# Altium schematic sheet BMS028B_Interface.SchDoc: Interface
size 431 x 279 mm; Date: Not shown in title block; ApprovedBy: Not shown in title block; CheckedBy: Not shown in title block; Author: Not shown in title block; CompanyName: Not shown in title block; DrawnBy: M Sunna; Engineer: Not shown in title block; Organization: Not shown in title block; Address1: Not shown in title block; Address2: Not shown in title block; Address3: Not shown in title block; Address4: Not shown in title block; DocumentNumber: 4; Revision: Use project parameter SCH_Rev; SheetNumber: 4; SheetTotal: 5; PageSetup: Record=PageOptions|CenterHorizontal=True|CenterVertical=True|PrintScale=1.00|XCorrection=1.00|YCorrection=1.00|PrintKind=0|BorderSize=5000000|LeftOffset=0|BottomOffset=0|Orientation=2|PaperLength=1000|PaperWidth=1000|Scale=100|PaperSource=15|PrintQuality=600|MediaType=1|DitherType=10|PaperKind=Letter|PrintScaleMode=1; CurrentTime: Not shown in title block; CurrentDate: Not shown in title block; Time: Not shown in title block; DocumentFullPathAndName: Not shown in title block; DocumentName: Not shown in title block; ModifiedDate: Not shown in title block; ImagePath: Not shown in title block
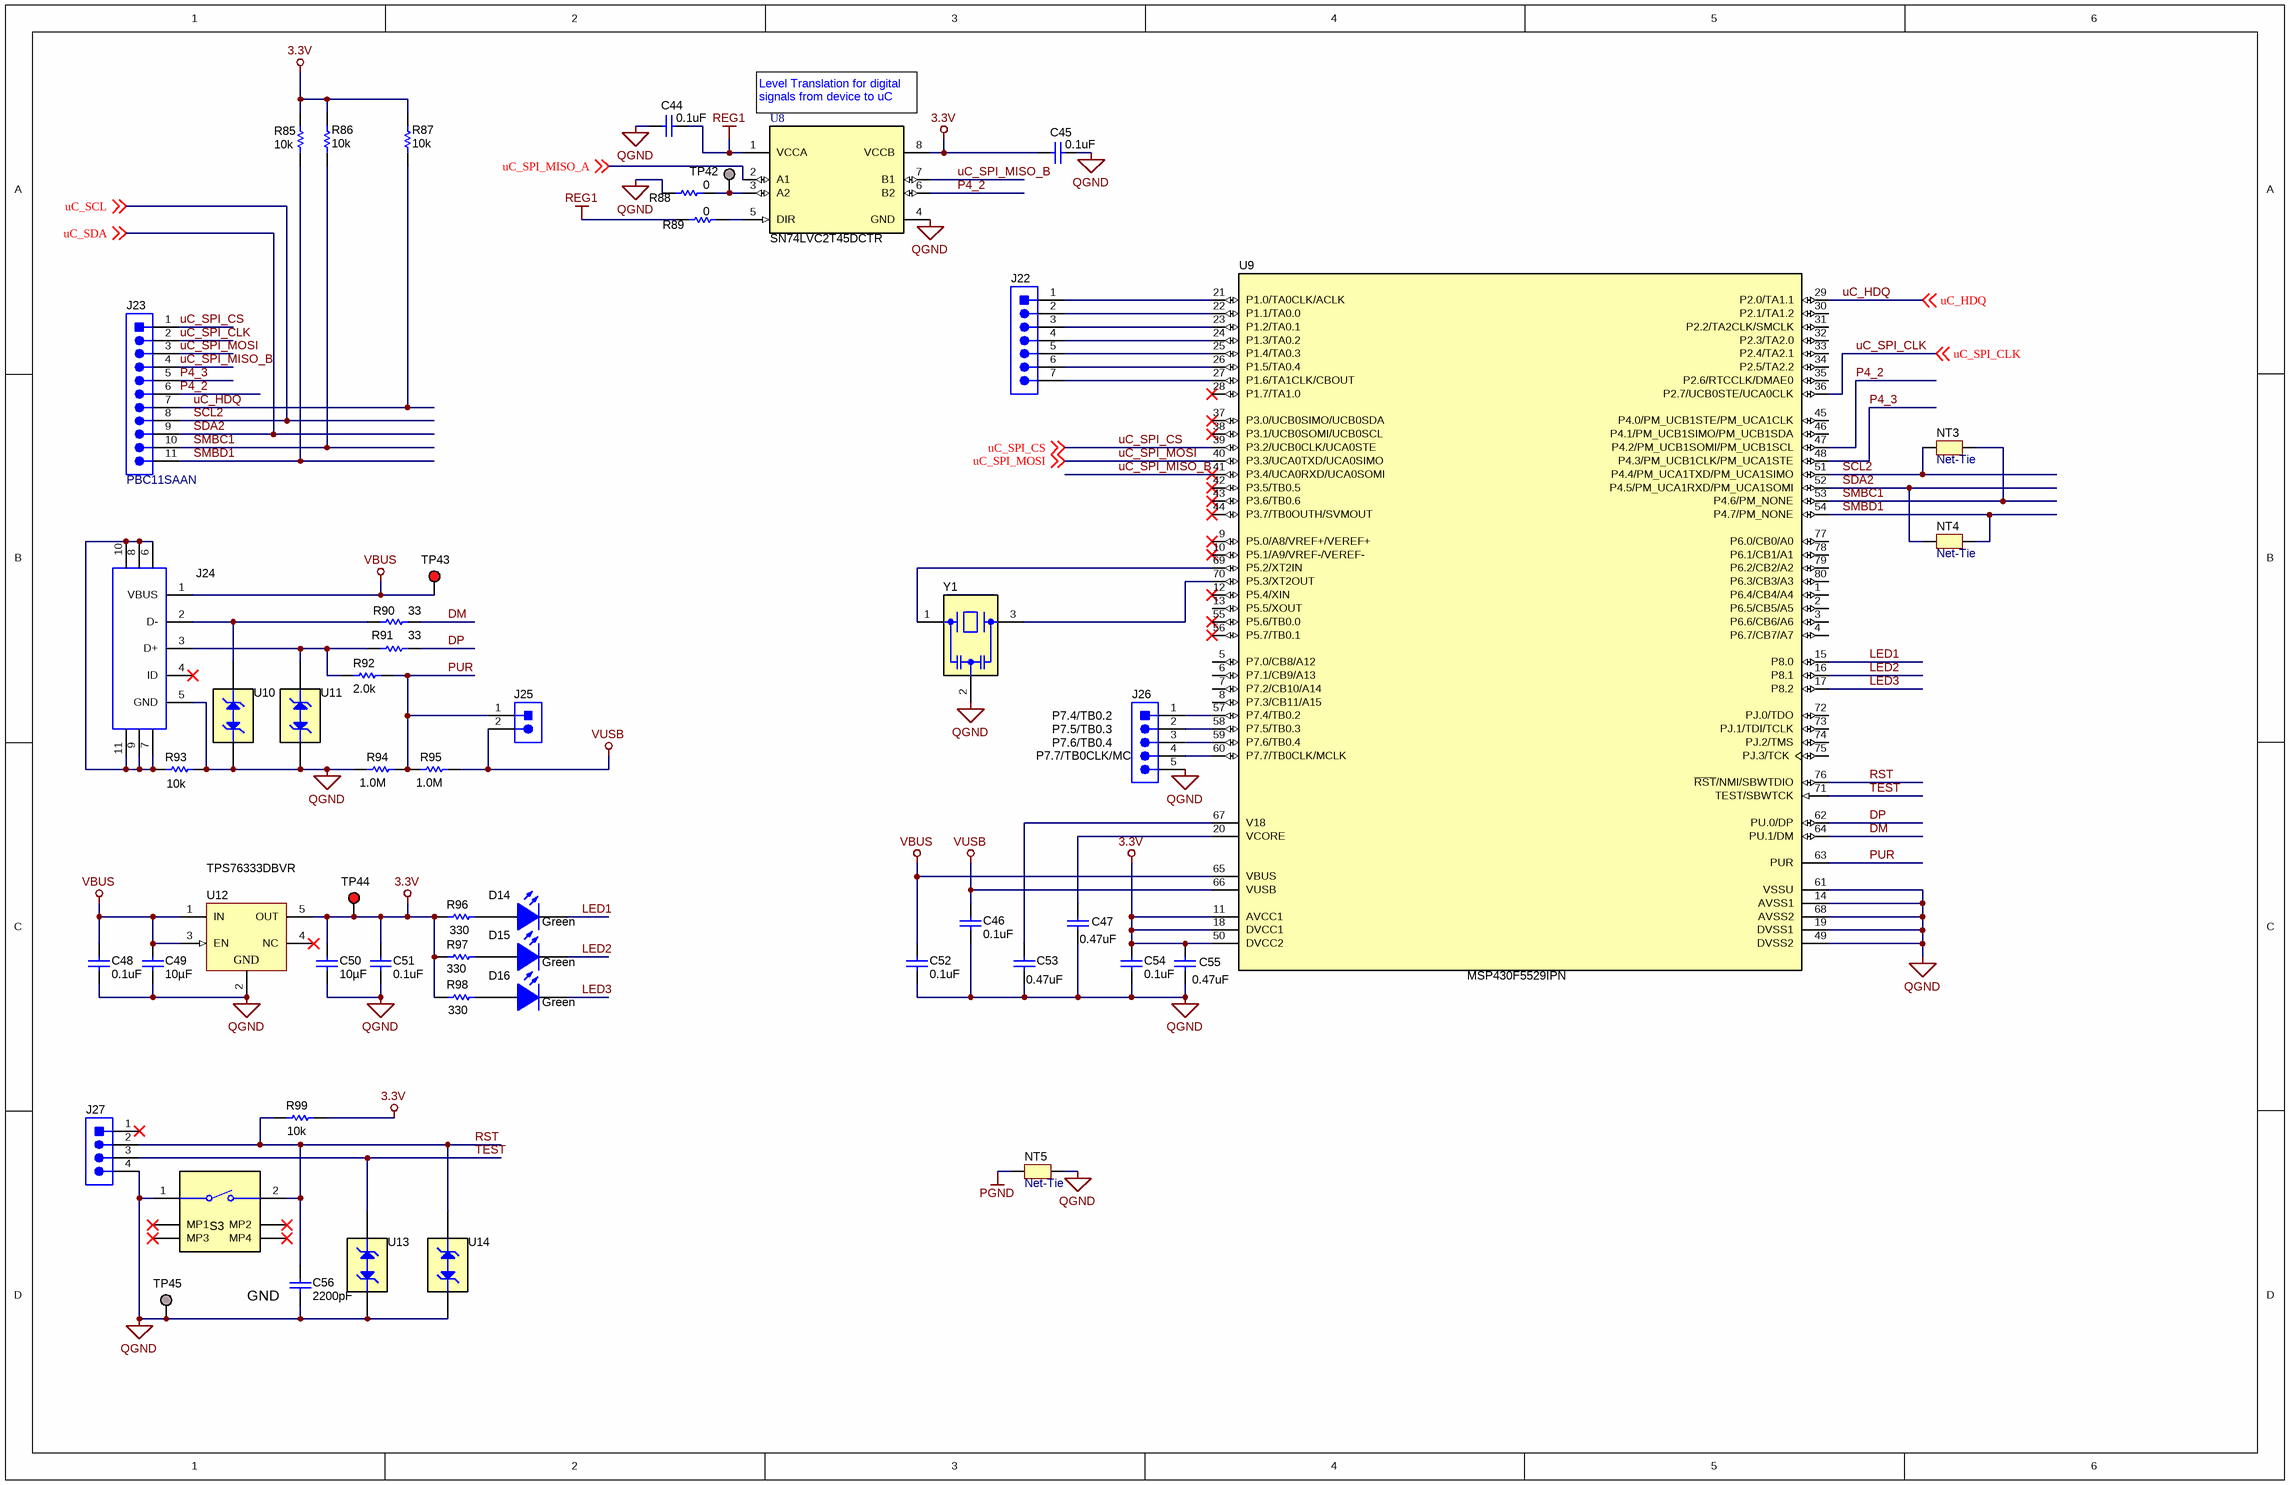
[diagram p0: BMS028B_Interface.SchDoc]

## Parts
C44  ValueDisplayed: 0.1uF  [0402]  (hidden comment: 885012205037)
C45  ValueDisplayed: 0.1uF  [0402]  (hidden comment: 885012205037)
C46  ValueDisplayed: 0.1uF  [0402]  (hidden comment: 885012205037)
C47  ValueDisplayed: 0.47uF  [0402]  (hidden comment: Capacitor)
C48  ValueDisplayed: 0.1uF  [0402]  (hidden comment: 885012205037)
C49  ValueDisplayed: 10µF  [0805_HV]  (hidden comment: CL21A106KOQNNNG)
C50  ValueDisplayed: 10µF  [0805_HV]  (hidden comment: CL21A106KOQNNNG)
C51  ValueDisplayed: 0.1uF  [0402]  (hidden comment: 885012205037)
C52  ValueDisplayed: 0.1uF  [0402]  (hidden comment: 885012205037)
C53  ValueDisplayed: 0.47uF  [0402]  (hidden comment: Capacitor)
C54  ValueDisplayed: 0.1uF  [0402]  (hidden comment: 885012205037)
C55  ValueDisplayed: 0.47uF  [0402]  (hidden comment: Capacitor)
C56  ValueDisplayed: 2200pF  [0402]  (hidden comment: 885012205008)
D14  value Green  [WL-SMCW_GREEN]  (hidden comment: 150060VS75000)
D15  value Green  [WL-SMCW_GREEN]  (hidden comment: 150060VS75000)
D16  value Green  [WL-SMCW_GREEN]  (hidden comment: 150060VS75000)
J22  PBC07SAAN  [Sullins_xxC07SAAN]  (value not drawn)
J23  PBC11SAAN  [Sullins_xxC11SAAN]
J24  CONN_USB_5Pos-6Shld  [Molex_47346-1001]  (value not drawn)
J25  61300211121  [WURTH_61300211121]  (value not drawn)
J26  PEC05SAAN  [Sullins_PxC05SAAN]  (value not drawn)
J27  22284043  [Molex_0022284043]  (value not drawn)
NT3  Net-Tie  [Net-Tie_10mil]  (net tie, no BOM)
NT4  Net-Tie  [Net-Tie_10mil]  (net tie, no BOM)
NT5  Net-Tie  [Net-Tie_0805_HV_NoOverlay]  (net tie, no BOM)
R85  ValueDisplayed: 10k  [0603]  (hidden comment: CRCW060310K0JNEA)
R86  ValueDisplayed: 10k  [0603]  (hidden comment: CRCW060310K0JNEA)
R87  ValueDisplayed: 10k  [0603]  (hidden comment: CRCW060310K0JNEA)
R88  ValueDisplayed: 0  [0603]  (hidden comment: CRCW06030000Z0EA)
R89  ValueDisplayed: 0  [0603]  (hidden comment: CRCW06030000Z0EA)
R90  ValueDisplayed: 33  [0402]  (hidden comment: Resistor)
R91  ValueDisplayed: 33  [0402]  (hidden comment: Resistor)
R92  ValueDisplayed: 2.0k  [0402]  (hidden comment: Resistor)
R93  ValueDisplayed: 10k  [0402]  (hidden comment: Resistor)
R94  ValueDisplayed: 1.0M  [0402]  (hidden comment: Resistor)
R95  ValueDisplayed: 1.0M  [0402]  (hidden comment: Resistor)
R96  ValueDisplayed: 330  [0402]  (hidden comment: Resistor)
R97  ValueDisplayed: 330  [0402]  (hidden comment: Resistor)
R98  ValueDisplayed: 330  [0402]  (hidden comment: Resistor)
R99  ValueDisplayed: 10k  [0402]  (hidden comment: Resistor)
S3  PTS820 J20M SMTR LFS  [SW_PTS820]  (value not drawn)
TP42  TESTPOINT  [TP_50MIL-25MILHOLE]  (value not drawn)  (no BOM)
TP43  5005  [Keystone5005]  (value not drawn)
TP44  5005  [Keystone5005]  (value not drawn)
TP45  TESTPOINT  [TP_SM_1MM]  (value not drawn)  (no BOM)
U8  SN74LVC2T45DCTR  [DCT0008A_N]
U9  PartNumber: MSP430F5529IPN  [PN0080A_N]  (hidden comment: CMP-0038965-1)
U10  TPD1E10B06DPYT  [DPY0002A]  (value not drawn)
U11  TPD1E10B06DPYT  [DPY0002A]  (value not drawn)
U12  PartNumber: TPS76333DBVR  [DBV0005A_N]  (hidden comment: CMP-0035539-1)
U13  TPD1E10B06DPYT  [DPY0002A]  (value not drawn)
U14  TPD1E10B06DPYT  [DPY0002A]  (value not drawn)
Y1  CSTCR4M00G55B-R0  [Murata_CSTCR_G]  (value not drawn)

## Nets
3.3V: C45.2 C50.1 C51.1 C54.1 C55.1 R85.1 R86.1 R87.1 R96.2 R97.2 R98.2 R99.2 TP44.1 U8.8(VCCB) U9.11(AVCC1) U9.18(DVCC1) U9.50(DVCC2) U12.5(OUT)
PGND: NT5.2
QGND: C44.1 C45.1 C46.2 C47.2 C48.2 C49.2 C50.2 C51.2 C52.2 C53.2 C54.2 C55.2 C56.2 J24.5(GND) J26.5 J27.4 NT5.1 R88.1 R93.1 R94.1 S3.1 TP45.1 U8.4(GND) U9.14(AVSS1) U9.19(DVSS1) U9.49(DVSS2) U9.61(VSSU) U9.68(AVSS2) U10.2(A) U11.2(A) U12.2(GND) U13.2(A) U14.2(A) Y1.2(GND)
REG1: C44.2 R89.1 U8.1(VCCA)
VBUS: C48.1 C49.1 C52.1 J24.1(VBUS) TP43.1 U9.65(VBUS) U12.1(IN) U12.3(EN)
VUSB: C46.1 J25.2 R95.2 U9.66(VUSB)
DM: R90.2 U9.64(PU.1/DM)
DP: R91.2 U9.62(PU.0/DP)
LED1: D14.1(K) U9.15(P8.0)
LED2: D15.1(K) U9.16(P8.1)
LED3: D16.1(K) U9.17(P8.2)
P4_2: J23.6 U8.6(B2) U9.47(P4.2/PM_UCB1SOMI/PM_UCB1SCL)
P4_3: J23.5 U9.48(P4.3/PM_UCB1CLK/PM_UCA1STE)
PUR: J25.1 R92.1 R94.2 R95.1 U9.63(PUR)
RST: C56.1 J27.2 R99.1 S3.2 U9.76(~{RST}/NMI/SBWTDIO) U14.1(K)
SCL2: J23.8 NT3.1 U9.51(P4.4/PM_UCA1TXD/PM_UCA1SIMO) ; off-sheet uC_SCL  [also labelled uC_SCL]
SDA2: J23.9 NT4.1 U9.52(P4.5/PM_UCA1RXD/PM_UCA1SOMI) ; off-sheet uC_SDA  [also labelled uC_SDA]
SMBC1: J23.10 NT3.2 R86.2 U9.53(P4.6/PM_NONE)
SMBD1: J23.11 NT4.2 R85.2 U9.54(P4.7/PM_NONE)
TEST: J27.3 U9.71(TEST/SBWTCK) U13.1(K)
uC_HDQ: J23.7 R87.2 U9.29(P2.0/TA1.1) ; off-sheet uC_HDQ
uC_SPI_CLK: J23.2 U9.36(P2.7/UCB0STE/UCA0CLK) ; off-sheet uC_SPI_CLK
uC_SPI_CS: J23.1 U9.39(P3.2/UCB0CLK/UCA0STE) ; off-sheet uC_SPI_CS
uC_SPI_MISO_A: U8.2(A1) ; off-sheet uC_SPI_MISO_A
uC_SPI_MISO_B: J23.4 U8.7(B1) U9.41(P3.4/UCA0RXD/UCA0SOMI)
uC_SPI_MOSI: J23.3 U9.40(P3.3/UCA0TXD/UCA0SIMO) ; off-sheet uC_SPI_MOSI
NetC47_1: C47.1 U9.20(VCORE)
NetC53_1: C53.1 U9.67(V18)
NetD14_2: D14.2(A) R96.1
NetD15_2: D15.2(A) R97.1
NetD16_2: D16.2(A) R98.1
NetJ22_1: J22.1 U9.21(P1.0/TA0CLK/ACLK)
NetJ22_2: J22.2 U9.22(P1.1/TA0.0)
NetJ22_3: J22.3 U9.23(P1.2/TA0.1)
NetJ22_4: J22.4 U9.24(P1.3/TA0.2)
NetJ22_5: J22.5 U9.25(P1.4/TA0.3)
NetJ22_6: J22.6 U9.26(P1.5/TA0.4)
NetJ22_7: J22.7 U9.27(P1.6/TA1CLK/CBOUT)
NetJ24_2: J24.2(D-) R90.1 U10.1(K)
NetJ24_3: J24.3(D+) R91.1 R92.2 U11.1(K)
NetJ24_6: J24.6 J24.7 J24.8 J24.9 J24.10 J24.11 R93.2
NetJ26_1: J26.1 U9.57(P7.4/TB0.2)
NetJ26_2: J26.2 U9.58(P7.5/TB0.3)
NetJ26_3: J26.3 U9.59(P7.6/TB0.4)
NetJ26_4: J26.4 U9.60(P7.7/TB0CLK/MCLK)
NetR88_2: R88.2 TP42.1 U8.3(A2)
NetR89_2: R89.2 U8.5(DIR)
NetU9_69: U9.69(P5.2/XT2IN) Y1.1(In)
NetU9_70: U9.70(P5.3/XT2OUT) Y1.3(Out)

Not connected (* = marked no-connect by the designer): J24 4(ID)*; J27 1*; S3 MP1* MP2* MP3* MP4*; U9 1(P6.4/CB4/A4) 2(P6.5/CB5/A5) 3(P6.6/CB6/A6) 4(P6.7/CB7/A7) 5(P7.0/CB8/A12) 6(P7.1/CB9/A13) 7(P7.2/CB10/A14) 8(P7.3/CB11/A15) 9(P5.0/A8/VREF+/VEREF+)* 10(P5.1/A9/VREF-/VEREF-)* 12(P5.4/XIN)* 13(P5.5/XOUT) 28(P1.7/TA1.0)* 30(P2.1/TA1.2) 31(P2.2/TA2CLK/SMCLK) 32(P2.3/TA2.0) 33(P2.4/TA2.1) 34(P2.5/TA2.2) 35(P2.6/RTCCLK/DMAE0) 37(P3.0/UCB0SIMO/UCB0SDA)* 38(P3.1/UCB0SOMI/UCB0SCL)* 42(P3.5/TB0.5)* 43(P3.6/TB0.6)* 44(P3.7/TB0OUTH/SVMOUT)* 45(P4.0/PM_UCB1STE/PM_UCA1CLK) 46(P4.1/PM_UCB1SIMO/PM_UCB1SDA) 55(P5.6/TB0.0)* 56(P5.7/TB0.1)* 72(PJ.0/TDO) 73(PJ.1/TDI/TCLK) 74(PJ.2/TMS) 75(PJ.3/TCK) 77(P6.0/CB0/A0) 78(P6.1/CB1/A1) 79(P6.2/CB2/A2) 80(P6.3/CB3/A3); U12 4(NC)*

## Notes on the sheet
- (near U8) Level Translation for digital signals from device to uC
- P7.5/TB0.3
- (near J26) P7.6/TB0.4
- P7.4/TB0.2
- (near J26) P7.7/TB0CLK/MCLK
- GND

## Library data of the parts
C44-C46 C48 C51 C52 C54 = CMP-0006228-2: CAP, CERM, 0.1 uF, 16 V, +/- 10%, X7R, 0402; Manufacturer: Wurth Elektronik; Polarized: N; Value: 0.1uF; U/M: EA; Cap_F: 100nF; Value1: Unknown; VDC_V: 16V; TaMin_C: -55°C; TaMax_C: 125°C; AEC Category: Q200; SizeArea_mm2: 0.5; SizeAreaWB_mm2: 3; SizeX_mm: 1; SizeZ_mm: 0.6; CompType: Capacitor; PartNumber: 885012205037; PackageReference: 0402; RoHS: Y; Tolerance_%: 10%; Value2: 16V; MountType: SMT; Technology: Ceramic; TempCo: X7R; Cap_Case: 0402; Published: 2008-06-19; Publisher: Texas Instruments; LatestRevisionDate: 2017-03-09; ComponentLink1Description: Datasheet link; ComponentLink1URL: http://katalog.we-online.de/pbs/datasheet/885012205037.pdf; Supplier 1: Digi-Key; Supplier Part Number 1: 732-7532-1-ND; Supplier 2: Mouser; Supplier Part Number 2: 710-885012205037; AEC Qualified: N; AEC Grade: N/A; SizeY_mm: 0.5
C47 C53 C55 = CMP-0006199-2: CAP, CERM, 0.47 uF, 6.3 V, +/- 10%, X5R, 0402; PartNumber: 04026D474KAT2A; Manufacturer: AVX; Polarized: N; Value: 0.47uF; U/M: EA; Cap_F: 470nF; Value1: Unknown; VDC_V: 6.3V; TaMin_C: -55°C; TaMax_C: 85°C; SizeArea_mm2: 0.5; SizeAreaWB_mm2: 3; SizeX_mm: 1; SizeZ_mm: 0.6; AEC Category: Q200; Green_Lifecycle: Active; Green_REACh: Passed; CompType: Capacitor; SymbolVersion: 2008-07-09; PackageReference: 0402; RoHS: Y; Tolerance_%: 10%; Value2: 6.3V; MountType: SMT; Technology: Ceramic; TempCo: X5R; Cap_Case: 0402; SizeY_mm: 0.5; Published: 2008-06-19; Publisher: Texas Instruments; LatestRevisionDate: 2017-03-09; ComponentLink1Description: Datasheet link; ComponentLink1URL: http://catalogs.avx.com/SurfaceMount.pdf; Supplier 1: Digi-Key; Supplier Part Number 1: 478-6196-1-ND; Supplier 2: Newark; Supplier Part Number 2: 60R6163; Supplier 3: Mouser; Supplier Part Number 3: 581-04026D474KAT2A; AEC Qualified: N; AEC Grade: N/A; Green_EU RoHS: Passed; Green_EU RoHS-2: Incomplete
C49 C50 = CMP-0085538-1: CAP, CERM, 10 µF, 16 V,+/- 10%, X5R, 0805; Manufacturer: Samsung Electro-Mechanics; Polarized: N; Value: 10uF; U/M: EA; VDC_V: 16V; TaMin_C: -55°C; TaMax_C: 85°C; Cap_Case: 0805; SizeArea_mm2: 2.5; SizeAreaWB_mm2: 6.75; SizeX_mm: 2; SizeY_mm: 1.25; SizeZ_mm: 1.45; AEC Category: Q200; CompType: Capacitor; PartNumber: CL21A106KOQNNNG; PackageReference: 0805; RoHS: Y; Cap_F: 10µF; Tolerance_%: 10%; Value2: 16V; MountType: SMT; Technology: Ceramic; TempCo: X5R; ComponentLink1Description: Datasheet link; ComponentLink1URL: http://www.samsungsem.com/kr/support/product-search/mlcc/__icsFiles/afieldfile/2018/06/20/CL21A106KOQNNNG.pdf; AEC Qualified: N; AEC Grade: N/A
C56 = CMP-0006224-2: CAP, CERM, 2200 pF, 10 V, +/- 10%, X7R, 0402; Manufacturer: Wurth Elektronik; Polarized: N; Value: 2200pF; U/M: EA; Cap_F: 2.2nF; Value1: Unknown; VDC_V: 10V; TaMin_C: -55°C; TaMax_C: 125°C; AEC Category: Q200; SizeArea_mm2: 0.5; SizeAreaWB_mm2: 3; SizeX_mm: 1; SizeZ_mm: 0.6; CompType: Capacitor; PartNumber: 885012205008; PackageReference: 0402; RoHS: Y; Tolerance_%: 10%; Value2: 10V; MountType: SMT; Technology: Ceramic; TempCo: X7R; Cap_Case: 0402; Published: 2008-06-19; Publisher: Texas Instruments; LatestRevisionDate: 2017-03-09; ComponentLink1Description: Datasheet link; ComponentLink1URL: http://katalog.we-online.de/pbs/datasheet/885012205008.pdf; Supplier 1: Digi-Key; Supplier Part Number 1: 732-7503-1-ND; Supplier 2: Mouser; Supplier Part Number 2: 710-885012205008; AEC Qualified: N; AEC Grade: N/A; SizeY_mm: 0.5
D14-D16 = CMP-0002894-2: LED, Green, SMD; Manufacturer: Wurth Elektronik; Type: AlInGaP; Value2: 2V; Io_A: 20mA; Value1: W; RoHS: Y; PackageReference: LED_0603; Color: green; MountType: SMT; CompType: LED; ComponentLink1Description: Datasheet link; ComponentLink1URL: http://katalog.we-online.de/led/datasheet/150060VS75000.pdf; Vf_V: 2V; PartNumber: 150060VS75000
J22 = CMP-0054584-1: Header, 2.54 mm, 7x1, Gold, TH; Manufacturer: Sullins Connector Solutions; CNHeader: TRUE; Current_A: 3A; Shrouded: N; Gender: Male; Voltage_V: 1.8kV; Row_Count: 1; Pitch_mm: 2.54; CT: FALSE; Cert_UL: Y; ComponentLink1URL: http://www.sullinscorp.com/catalogs/77_PAGE108-109_.100_MALE_HDR.pdf; ClassName: Header; Publisher: Texas Instruments; Color: Black; RoHS: Y; MountType: TH; Supplier 1: Digi-Key; PackageReference: Header, 2.54 mm, 7x1, TH; PinCount: 7; CompType: Header; LatestRevisionDate: 26/05/2017; PartNumber: PBC07SAAN; Orientation: Vertical; ComponentLink1Description: Datasheet URL; Supplier Part Number 1: S1011E-07-ND; ContactFinish: Gold
J23 = CMP-0054585-1: Header, 2.54 mm, 11x1, Gold, TH; Manufacturer: Sullins Connector Solutions; CNHeader: TRUE; Current_A: 3A; Shrouded: N; Gender: Male; Voltage_V: 1.8kV; Row_Count: 1; Pitch_mm: 2.54; CT: FALSE; Cert_UL: Y; ComponentLink1URL: http://www.sullinscorp.com/catalogs/77_PAGE108-109_.100_MALE_HDR.pdf; ClassName: Header; Publisher: Texas Instruments; Color: Black; RoHS: Y; MountType: TH; Supplier 1: Digi-Key; PackageReference: Header, 2.54 mm, 11x1, TH; PinCount: 11; CompType: Header; LatestRevisionDate: 26/05/2017; PartNumber: PBC11SAAN; Orientation: Vertical; ComponentLink1Description: Datasheet URL; Supplier Part Number 1: S1011E-11-ND; ContactFinish: Gold
J24 = CMP-0055304-1: Receptacle, Micro-USB Type B, 0.65 mm, 5x1, R/A, Bottom Mount SMT; PartNumber: 47346-1001; Manufacturer: Molex; SymbolCreator: a0411947; CompType: USB; Gender: Female; CT: TRUE; CNHeader: FALSE; SymbolVersion: 2013-06-26; PackageReference: Receptacle, 0.65mm, 5x1, R/A, SMT; RoHS: Y; MountType: SMT; ComponentLink1Description: Datasheet URL; ComponentLink1URL: http://www.molex.com/pdm_docs/sd/473461001_sd.pdf; Publisher: Texas Instruments; LatestRevisionDate: 26/05/2017; Supplier 1: Newark; Supplier Part Number 1: 06X9936; Supplier 2: Mouser; Supplier Part Number 2: 538-47346-1001
J25 = CMP-0054794-2: Header, 2.54 mm, 2x1, Gold, TH; Manufacturer: Wurth Elektronik; Green_Lifecycle: Active; Green_REACh: Passed; Cert_UL: Y; Gender: Male; Pitch_mm: 2.54; Row_Count: 1; Shrouded: N; ComponentLink1URL: http://katalog.we-online.de/em/datasheet/6130xx11121.pdf; ClassName: Header; Supplier Part Number 2: 20X0948; Supplier 2: Newark; Supplier Part Number 3: 710-61300211121; Supplier 3: Mouser; RoHS: Y; MountType: TH; Green_EU RoHS-2: Incomplete; Supplier 1: Digi-Key; Green_EU RoHS: Passed; PackageReference: Header, 2.54mm, 2x1, TH; CompType: Header; PartNumber: 61300211121; ComponentLink1Description: Datasheet URL; Supplier Part Number 1: 732-5315-ND; Color: Black; ContactFinish: Gold; Orientation: Vertical; PinCount: 2
J26 = CMP-0054597-1: Header, 2.54mm, 5x1, Tin, TH; Manufacturer: Sullins Connector Solutions; CNHeader: TRUE; Current_A: 3A; Green_Lifecycle: Not Set; Shrouded: N; Gender: Male; Green_REACh: Incomplete; Voltage_V: 1.8kV; Row_Count: 1; Pitch_mm: 2.54; CT: FALSE; Cert_UL: Y; ComponentLink1URL: http://www.sullinscorp.com/catalogs/77_PAGE108-109_.100_MALE_HDR.pdf; ClassName: Header; Publisher: Texas Instruments; Color: Black; RoHS: Y; MountType: TH; Green_EU RoHS-2: Incomplete; Supplier 1: Digi-Key; Green_EU RoHS: Incomplete; PackageReference: Header, 2.54mm, 5x1, TH; PinCount: 5; CompType: Header; LatestRevisionDate: 26/05/2017; PartNumber: PEC05SAAN; Orientation: Vertical; ComponentLink1Description: Datasheet URL; Supplier Part Number 1: S1012E-05-ND; ContactFinish: Tin
J27 = CMP-0055331-1: Header, 2.54mm, 4x1, Tin, TH; Manufacturer: Molex; Pitch_mm: 2.54; Gender: Male; Shrouded: N; Row_Count: 1; Current_A: 4A; Voltage_V: 250V; Cert_UL: Y; CNHeader: TRUE; CT: FALSE; PartNumber: 22284043; PackageReference: Header, 2.54mm, 4x1, TH; ClassName: Header; CompType: Header; RoHS: Y; MountType: TH; ComponentLink1Description: Datasheet URL; ComponentLink1URL: http://www.molex.com/pdm_docs/sd/022284043_sd.pdf; Orientation: Vertical; PinCount: 4; ContactFinish: Tin; Color: Black; Publisher: Texas Instruments; LatestRevisionDate: 26/05/2017; Supplier 1: Digi-Key; Supplier Part Number 1: WM50016-04-ND
NT3-NT5 = CMP-0078142-3: Single point connection between nets.; CompType: Net-Tie; PackageReference: N/A; Library Reference: Net-Tie; Manufacturer: N/A; PartNumber: N/A; MountType: SMT
R85 R87 = CMP-0025701-4: RES, 10 k, 5%, 0.1 W, AEC-Q200 Grade 0, 0603; Manufacturer: Vishay-Dale; Power_W: 100mW; TempCo: 200 ppm/C; Value_Code: 10k0; Value: 10k; EIA_Code: E24; SizeX_mm: 1.6; SizeY_mm: 0.8; SizeZ_mm: 1; Value2: 0.1W; SizeArea_mm2: 1.28; AEC Qualified: Y; VDC_V: 75V; AEC Category: Q200; AEC Grade: 0; Supplier Part Number 2: 52K8066; Supplier 2: Newark; Supplier Part Number 3: 71-CRCW0603J-10K-E3; Supplier 3: Mouser; RoHS: E; Value1: 5%; MountType: SMT; Supplier 1: Digi-Key; PackageReference: 0603; Tolerance_%: 5%; Res_ohm: 10k; CompType: Resistor; PartNumber: CRCW060310K0JNEA; ComponentLink1Description: Datasheet link; Supplier Part Number 1: 541-10KGCT-ND; Technology: Thick Film; ComponentLink1URL: http://www.vishay.com/docs/20035/dcrcwe3.pdf
R86 = CMP-0025701-4: RES, 10 k, 5%, 0.1 W, AEC-Q200 Grade 0, 0603; Manufacturer: Vishay-Dale; Power_W: 100mW; TempCo: 200 ppm/C; Value_Code: 10k0; Value: 10k; EIA_Code: E24; SizeX_mm: 1.6; SizeY_mm: 0.8; SizeZ_mm: 1; Value2: 0.1W; SizeArea_mm2: 1.28; CompType: Resistor; AEC Qualified: Y; VDC_V: 75V; AEC Category: Q200; AEC Grade: 0; Supplier Part Number 2: 52K8066; Supplier 2: Newark; Supplier Part Number 3: 71-CRCW0603J-10K-E3; Supplier 3: Mouser; RoHS: E; Value1: 5%; MountType: SMT; Supplier 1: Digi-Key; PackageReference: 0603; Tolerance_%: 5%; Res_ohm: 10k; PartNumber: CRCW060310K0JNEA; ComponentLink1Description: Datasheet link; Supplier Part Number 1: 541-10KGCT-ND; Technology: Thick Film; ComponentLink1URL: http://www.vishay.com/docs/20035/dcrcwe3.pdf
R88 R89 = CMP-0025697-4: RES, 0, 5%, 0.1 W, AEC-Q200 Grade 0, 0603; Manufacturer: Vishay-Dale; Value: 0; Value_Code: 0000; Power_W: 100mW; Value2: 0.1W; VDC_V: 75V; TempCo: 200 ppm/C; EIA_Code: E24; SizeArea_mm2: 1.28; SizeX_mm: 1.6; SizeY_mm: 0.8; SizeZ_mm: 1; AEC Category: Q200; AEC Qualified: Y; CompType: Resistor; PartNumber: CRCW06030000Z0EA; PackageReference: 0603; RoHS: E; Res_ohm: 0; Tolerance_%: 5%; Value1: 5%; MountType: SMT; Technology: Thick Film; ComponentLink1Description: Datasheet link; ComponentLink1URL: http://www.vishay.com/docs/20035/dcrcwe3.pdf; Supplier 1: Digi-Key; Supplier Part Number 1: 541-0.0GCT-ND; Supplier 2: Newark; Supplier Part Number 2: 52K8014; Supplier 3: Mouser; Supplier Part Number 3: 71-CRCW0603-0-E3; AEC Grade: 0
R90 R91 = CMP-0026908-3: RES, 33, 5%, 0.063 W, AEC-Q200 Grade 0, 0402; PartNumber: CRCW040233R0JNED; Manufacturer: Vishay-Dale; Value: 33; Value_Code: 33R0; Power_W: 63mW; Value2: 0.063W; VDC_V: 50V; TempCo: 200 ppm/C; SizeArea_mm2: 0.5; SizeX_mm: 1; SizeZ_mm: 0.6; EIA_Code: E24; U/M: EA; AEC Category: Q200; AEC Qualified: Y; AEC Grade: 0; CompType: Resistor; SymbolVersion: 2009-05-29; PackageReference: 0402; RoHS: E; Res_ohm: 33; Tolerance_%: 5%; Value1: 5%; MountType: SMT; Technology: Thick Film; SizeY_mm: 0.5; Published: 2008-06-26; Publisher: Texas Instruments; LatestRevisionDate: 2017-06-12; ComponentLink1Description: Datasheet link; ComponentLink1URL: http://www.vishay.com/docs/20035/dcrcwe3.pdf; Supplier 1: Digi-Key; Supplier Part Number 1: 541-33JCT-ND; Supplier 2: Newark; Supplier Part Number 2: 72M6782; Supplier 3: Mouser; Supplier Part Number 3: 71-CRCW0402J-33-E3
R92 = CMP-0026889-5: RES, 2.0 k, 5%, 0.063 W, AEC-Q200 Grade 0, 0402; PartNumber: CRCW04022K00JNED; Manufacturer: Vishay-Dale; Value: 2.0k; Res_ohm: 2k; Value_Code: 2k00; Power_W: 63mW; Value2: 0.063W; VDC_V: 50V; TempCo: 200 ppm/C; SizeArea_mm2: 0.5; SizeX_mm: 1; SizeZ_mm: 0.6; EIA_Code: E24; U/M: EA; AEC Category: Q200; AEC Qualified: Y; AEC Grade: 0; CompType: Resistor; SymbolVersion: 2009-05-29; PackageReference: 0402; RoHS: E; Tolerance_%: 5%; Value1: 5%; MountType: SMT; Technology: Thick Film; SizeY_mm: 0.5; Published: 2008-06-26; Publisher: Texas Instruments; LatestRevisionDate: 2017-06-12; ComponentLink1Description: Datasheet link; ComponentLink1URL: http://www.vishay.com/docs/20035/dcrcwe3.pdf; Supplier 1: Digi-Key; Supplier Part Number 1: 541-2.0KJCT-ND; Supplier 2: Newark; Supplier Part Number 2: 59M6709; Supplier 3: Mouser; Supplier Part Number 3: 71-CRCW0402J-2K-E3
R93 R99 = CMP-0026825-5: RES, 10 k, 5%, 0.063 W, AEC-Q200 Grade 0, 0402; PartNumber: CRCW040210K0JNED; Manufacturer: Vishay-Dale; Value: 10k; Value_Code: 10k0; Power_W: 63mW; Value2: 0.063W; VDC_V: 50V; TempCo: 200 ppm/C; EIA_Code: E24; U/M: EA; AEC Category: Q200; AEC Qualified: Y; AEC Grade: 0; SizeArea_mm2: 0.5; SizeX_mm: 1; SizeZ_mm: 0.6; CompType: Resistor; SymbolVersion: 2009-05-29; PackageReference: 0402; RoHS: E; Res_ohm: 10k; Tolerance_%: 5%; Value1: 5%; MountType: SMT; Technology: Thick Film; Published: 2008-06-26; Publisher: Texas Instruments; LatestRevisionDate: 2017-06-12; ComponentLink1Description: Datasheet link; ComponentLink1URL: http://www.vishay.com/docs/20035/dcrcwe3.pdf; Supplier 1: Digi-Key; Supplier Part Number 1: 541-10KJCT-ND; Supplier 2: Newark; Supplier Part Number 2: 59M6696; Supplier 3: Mouser; Supplier Part Number 3: 71-CRCW0402J-10K-E3; SizeY_mm: 0.5
R94 R95 = CMP-0026859-2: RES, 1.0 M, 5%, 0.063 W, AEC-Q200 Grade 0, 0402; PartNumber: CRCW04021M00JNED; Manufacturer: Vishay-Dale; Value: 1.0Meg; Res_ohm: 1M; Value_Code: 1M00; Power_W: 63mW; Value2: 0.063W; VDC_V: 50V; TempCo: 200 ppm/C; SizeArea_mm2: 0.5; SizeX_mm: 1; SizeZ_mm: 0.6; EIA_Code: E24; U/M: EA; AEC Category: Q200; AEC Qualified: Y; AEC Grade: 0; CompType: Resistor; SymbolVersion: 2009-05-29; PackageReference: 0402; RoHS: E; Tolerance_%: 5%; Value1: 5%; MountType: SMT; Technology: Thick Film; SizeY_mm: 0.5; Published: 2008-06-26; Publisher: Texas Instruments; LatestRevisionDate: 2017-06-12; ComponentLink1Description: Datasheet link; ComponentLink1URL: http://www.vishay.com/docs/20035/dcrcwe3.pdf; Supplier 1: Digi-Key; Supplier Part Number 1: 541-1.0MJCT-ND; Supplier 2: Newark; Supplier Part Number 2: 59M6694; Supplier 3: Mouser; Supplier Part Number 3: 71-CRCW0402J-1M-E3
R96-R98 = CMP-0026694-1: RES, 330, 1%, 0.1 W, AEC-Q200 Grade 0, 0402; PartNumber: ERJ-2RKF3300X; Manufacturer: Panasonic; Value: 330; Value_Code: 330R; Power_W: 100mW; Value2: 0.1W; VDC_V: 50V; TempCo: 100 ppm/C; SizeArea_mm2: 0.5; SizeX_mm: 1; SizeZ_mm: 0.6; U/M: EA; AEC Category: Q200; AEC Qualified: Y; AEC Grade: 0; Green_Lifecycle: Active; Green_REACh: Passed; CompType: Resistor; SymbolVersion: 2009-05-29; PackageReference: 0402; RoHS: Y; Res_ohm: 330; Tolerance_%: 1%; Value1: 1%; MountType: SMT; Technology: Thick Film; SizeY_mm: 0.5; Published: 2008-06-26; Publisher: Texas Instruments; LatestRevisionDate: 2017-03-09; ComponentLink1Description: Datasheet link; ComponentLink1URL: http://industrial.panasonic.com/lecs/www-data/pdf/AOA0000/AOA0000CE2.pdf; Supplier 1: Digi-Key; Supplier Part Number 1: P330LCT-ND; Supplier 2: Newark; Supplier Part Number 2: 64R5277; Supplier 3: Farnell; Supplier Part Number 3: 2397127; Green_EU RoHS: Passed with Exemption; Green_EU RoHS-2: Incomplete
S3 = CMP-0002246-2: Switch, SPST-NO,  Off-Mom, 0.05A, 12VDC, SMD; Manufacturer: C&K Components; VDC_V: 12V; PositionCount: 1; CurrentRating_mA: 50A; PartNumber: PTS820 J20M SMTR LFS; MountType: SMT; ComponentLink1Description: Datasheet Link; ComponentLink1URL: http://www.ck-components.com/80184/pts820_4mar13.pdf/; RoHS: Y; Circuit: SPST-NO; SwitchFunction: Off-Mom; Orientation: Top Actuated; CompType: Switch; PackageReference: 3.9x2.9mm; Publisher: Texas Instruments; LatestRevisionDate: 2017-03-09; Supplier 1: Digi-Key; Supplier Part Number 1: CKN10505CT-ND; Supplier 2: Mouser; Supplier Part Number 2: 611-PTS820J20MSMTR
TP42 = CMP-0078143-2: TEST POINT.  No entry in BOM.; PartNumber: N/A; CompType: Testpoint; Manufacturer: N/A; PackageReference: N/A; Library Reference: TESTPOINT
TP43 TP44 = CMP-0055142-1: Test Point, Compact, Red, TH; Manufacturer: Keystone; U/M: EA; CNHeader: FALSE; Green_Lifecycle: Active; Green_REACh: Passed; ContactFinish: Silver; CT: TRUE; SymbolVersion: 2008-04-04; PartNumber: 5005; Value: Red; PackageReference: Red Compact Testpoint; CompType: Test Point; RoHS: Y; MountType: TH; ComponentLink1Description: Datasheet URL; ComponentLink1URL: http://www.keyelco.com/userAssets/file/M60-2p60.pdf; Publisher: Texas Instruments; LatestRevisionDate: 26/05/2017; Supplier 1: Digi-Key; Supplier Part Number 1: 36-5005-ND; Supplier 2: Mouser; Supplier Part Number 2: 534-5005; Color: Red; Green_EU RoHS-2: Passed; Green_EU RoHS: Passed
TP45 = CMP-0003825-1: 1mm Test Point, SMT; Manufacturer: Any; SymbolVersion: 2010-10-20; PartNumber: TP_SM_1MM; CompType: Test Point; PackageReference: 1mm Test Point, SMT; MountType: SMT; ComponentLink1Description: Datasheet Link; ComponentLink1URL: https://sps06.itg.ti.com/sites/KMS/crossdivteams/altium/docs/ComponentDatasheets/PROBE_TEST_POINT.png; Publisher: Texas Instruments; LatestRevisionDate: 2017-03-09; Key: TP_SM_1MM
U8 = CMP-0051048-2: Dual-Bit Dual Supply Transceiver with Configurable Voltage Translation and 3-State Outputs, DCT0008A, LARGE T&R; Manufacturer: Texas Instruments; Rating: Military; Input Type: CMOS/TTL; Schmitt Trigger: No; ICC @ Nom Voltage(Max)(mA): 0.004; Bits(#): 2; Logic: True; tpd @ Nom Voltage(Max)(ns): 17.7,10.3,8.3,7.2; VCC(Min)(V): 1.65; Voltage(Nom)(V): 1.8,2.5,3.3,5; Output Type: CMOS; F @ Nom Voltage(Max)(Mhz): 150; Technology Family: LVC; VCC(Max)(V): 5.5; Output Drive (IOL/IOH)(Max)(mA): 32/-32; 3-State Output: Yes; Sub-Family: Dual Supply Translator; AEC Category: Q200; AEC Qualified: N; CompType: IC; SizeAreaWB_mm2: 19; SizeArea_mm2: 11.2; SizeX_mm: 4; SizeY_mm: 2.8; SizeZ_mm: 1.3; Operating Temperature Range(C): -40 to 85; DatasheetVersion: SCES516J; Generic Part Number: SN74LVC2T45; PackageReference: DCT0008A; ComponentLink1Description: Datasheet Link; ComponentLink1URL: http://www.ti.com/lit/ds/symlink/sn74lvc2t45.pdf; ComponentLink2Description: Product Folder; ComponentLink2URL: http://www.ti.com/product/sn74lvc2t45; MountType: SMT; PackageDescription: SSOP-8; PartNumber: SN74LVC2T45DCTR; RoHS: Y
U9 = CMP-0038965-1: 25 MHz Mixed Signal Microcontroller with 128 KB Flash, 8192 B SRAM and 63 GPIOs, -40 to 85 degC, 80-pin QFP (PN), Green (RoHS & no Sb/Br); Manufacturer: Texas Instruments; ADC: 12-bit SAR; ADC Channels: 16; Brown Out Reset: Yes; DMA: 3; Flash(KB): 128; Frequency(MHz): 25; GPIO: 63; Multiplier: 32x32; SRAM(B): 8192; SubFamily: 5 Series; Timers - 16-bit: 4; USB: 1; USCI_A (UART/LIN/IrDA/SPI): 2; DatasheetVersion: SLAS590I; PackageReference: PN0080A; PackageDescription: 80-Pin Plastic Quad Flat Pack, Body 12 x 12 mm, Pitch 0.5 mm; Comparators: Yes; Eco-Plan: Green (RoHS & no Sb/Br); Real-Time Clock: Yes; SVS: Yes; Temp Sensor: Yes; USCI_B (I2C & SPI): 2; Watchdog: Yes; Code_JEDEC: MS-018; ComponentLink1Description: Manufacturer URL; ComponentLink1URL: http://www.ti.com/; ComponentLink2Description: Datasheet; ComponentLink2URL: http://www.ti.com/general/docs/lit/getliterature.tsp?genericPartNumber=MSP430F5529&fileType=pdf; ComponentLink3Description: Package Specification; ComponentLink3URL: http://www.ti.com/lit/ml/mtqf010a/mtqf010a.pdf; Mounting Technology: Surface Mount
U10 U11 U13 U14 = CMP-0043094-3: Single-Channel ESD in 0402 Package With 10pF Capacitance and 6V Breakdown, DPY0002A (X1SON-2); Manufacturer: Texas Instruments; Alternate PartNumber: TPD1E10B06DPYR; IEC 61000-4-2 Air-Gap(+/- kV): 30; Eco-Plan: TBD; IO Capacitance(Typ)(pF): 10; Breakdown Voltage(Min)(V): 6; AEC Category: Q200; AEC Qualified: N; CompType: IC; SizeAreaWB_mm2: 3.2; SizeArea_mm2: 0.6; SizeX_mm: 1.0; SizeZ_mm: 0.45; Rating: Catalog; ComponentLink3Description: Online Datasheet; PackageReference: DPY0002A; PackageDescription: X1SON-2; ComponentLink2URL: http://www.ti.com/product/tpd1e10b06; ComponentLink1URL: http://www.ti.com/lit/ds/symlink/tpd1e10b06.pdf; ComponentLink3URL: http://www.ti.com/product/tpd1e10b06/datasheet; IO Leakage Current(nA): 10; ComponentLink1Description: Datasheet Link; ComponentLink2Description: Product Folder; PartNumber: TPD1E10B06DPYT; IEC 61000-4-2 Contact(+/- kV): 30; Alternate Manufacturer: Texas Instruments; MountType: SMT; RoHS: Y; SizeY_mm: 0.6; Operating Temperature Range: -40 to 125 C
U12 = CMP-0035539-1: Single Output LDO, 150 mA, Fixed 3.3 V Output, 2.7 to 10 V Input, with Low IQ, 5-pin SOT-23 (DBV), -40 to 125 degC, Green (RoHS & no Sb/Br); Manufacturer: Texas Instruments; Accuracy(%): 3; Fixed Output Options(V): 3.3; Iout(Max)(A): 0.15; Iq(Typ)(mA): 0.08; SubFamily: Single Channel LDO; Vdo(Typ)(mV): 300; Vin(Max)(V): 10; Vin(Min)(V): 2.7; DatasheetVersion: SLVS181H; PackageVersion: 4073253-4/K; PackageReference: DBV0005A; PackageDescription: 5-Pin Plastic Small Outline, Body 1.60 Ãƒâ€” 2.90 mm, Pitch 0.95 mm; Eco-Plan: Green (RoHS & no Sb/Br); Vout Adj(Max)(V): 3.3; Vout Adj(Min)(V): 3.3; Code_JEDEC: MO-178; ComponentLink1Description: Manufacturer URL; ComponentLink1URL: http://www.ti.com/; ComponentLink2Description: Datasheet; ComponentLink2URL: http://www.ti.com/general/docs/lit/getliterature.tsp?genericPartNumber=TPS76333&fileType=pdf; ComponentLink3Description: Package Specification; ComponentLink3URL: http://www.ti.com/litv/pdf/mpds018i; Mounting Technology: Surface Mount
Y1 = CMP-0084387-1: Resonator, 4 MHz, 39 pF, AEC-Q200 Grade 1, SMD; Manufacturer: MuRata; Frequency_Fixed: 4MHz; SizeAreaWB_mm2: 16.5; SizeArea_mm2: 9; SizeX_mm: 4.5; SizeY_mm: 2; SizeZ_mm: 1.2; TaMin_C: -40°C; TaMax_C: 125°C; AEC Category: Q200; AEC Grade: 1; AEC Qualified: Y; Load Capacitance: 39 pF; PartNumber: CSTCR4M00G55B-R0; CompType: Resonator; PackageReference: 4.5x1.2x2 mm; MountType: SMT; RoHS: Y; ComponentLink1Description: Datasheet Link; ComponentLink1URL: https://www.murata.com/~/media/webrenewal/support/library/catalog/products/timingdevice/ceralock/p16e.ashx